# Altium schematic sheet HighCurrent.SchDoc
size A
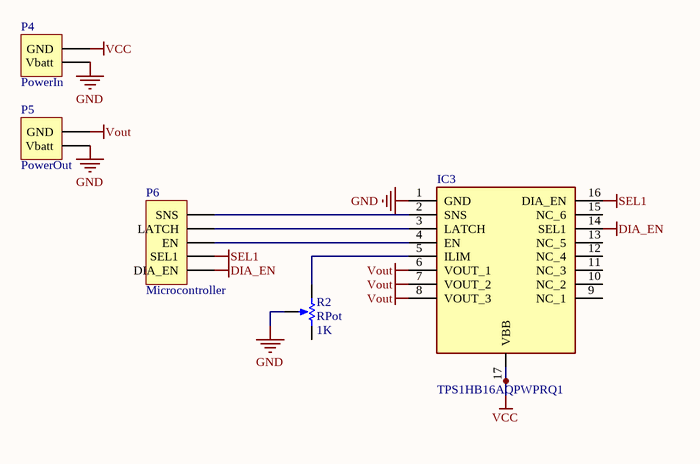
[diagram p0: HighCurrent.SchDoc]

## Parts
IC3  TPS1HB16AQPWPRQ1  [SOP65P640X120-17N]
P4  PowerIn  [HDR1X2]
P5  PowerOut  [HDR1X2]
P6  Microcontroller  [HDR1X5]
R2  RPot  value 1K  [VR5]

## Nets
DIA_EN: IC3.14(SEL1) P6.5(DIA_EN)
GND: IC3.1(GND) P4.1(Vbatt) P5.1(Vbatt) R2.3(TAP)
SEL1: IC3.16(DIA_EN) P6.4(SEL1)
VCC: IC3.17(VBB) P4.2(GND)
Vout: IC3.6(VOUT_1) IC3.7(VOUT_2) IC3.8(VOUT_3) P5.2(GND)
NetIC3_2: IC3.2(SNS) P6.1(SNS)
NetIC3_3: IC3.3(LATCH) P6.2(LATCH)
NetIC3_4: IC3.4(EN) P6.3(EN)
NetIC3_5: IC3.5(ILIM) R2.1(TOP)

Not connected (* = marked no-connect by the designer): IC3 9(NC_1) 10(NC_2) 11(NC_3) 12(NC_4) 13(NC_5) 15(NC_6); R2 2(BOT)

## Library data of the parts
IC3 = TPS1HB16AQPWPRQ1: Integrated Circuit; Manufacturer_Name: Texas Instruments; Datasheet Link: https://www.ti.com/lit/ds/symlink/tps1hb16-q1.pdf?ts=1598538997170&ref_url=https%253A%252F%252Fwww.ti.com%252Fproduct%252FTPS1HB16-Q1; Height: 1.2mm; Manufacturer_Part_Number: TPS1HB16AQPWPRQ1; Mouser Part Number: 595-TPS1HB16AQPWPRQ1; Mouser Price/Stock: https://www.mouser.co.uk/ProductDetail/Texas-Instruments/TPS1HB16AQPWPRQ1?qs=vmHwEFxEFR9VMSMq1HvLwg%3D%3D
P4 P5 = Header 2: Power Header; LatestRevisionDate: 17-Jul-2002; LatestRevisionNote: Re-released for DXP Platform.; Publisher: Altium Limited
P6 = Header 5: Header, 5-Pin; LatestRevisionDate: 17-Jul-2002; LatestRevisionNote: Re-released for DXP Platform.; Publisher: Altium Limited
R2 = RPot: Potentiometer; Sim Note: Enter the Resistance value and the set point into parameter fields.; Set Position: 0.5; Published: 8-Jun-2000; LatestRevisionDate: 17-Jul-2002; LatestRevisionNote: Re-released for DXP Platform.; PackageReference: VR5; Publisher: Altium Limited; PackageDescription: Variable Resistor, Thru-Hole; 3 Leads